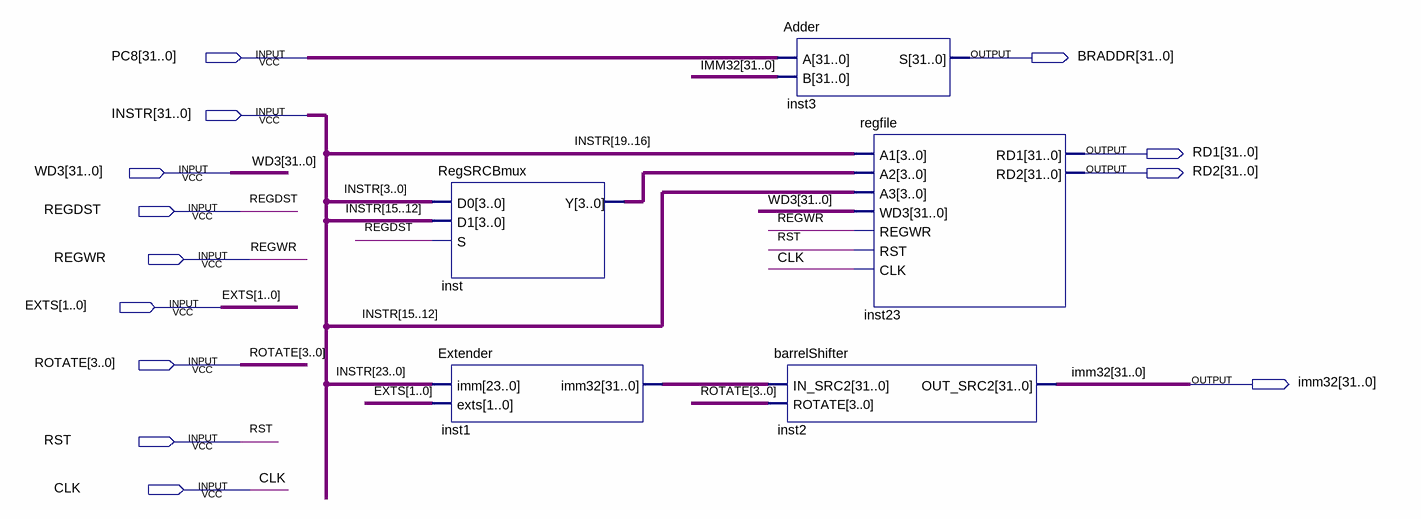
[diagram p0: schematic sheet]
// Quartus schematic Decode.bdf as structural Verilog: 5 symbols, 13 pins
module Decode (
  input  [31:0] PC8,
  input  [31:0] INSTR,
  input  [31:0] WD3,
  input  REGDST,
  input  REGWR,
  input  [1:0] EXTS,
  input  [3:0] ROTATE,
  input  RST,
  input  CLK,
  output [31:0] BRADDR,
  output [31:0] RD1,
  output [31:0] RD2,
  output [31:0] imm32
);

  wire [3:0] inst_y;
  wire [31:0] inst1_imm32;

  RegSRCBmux inst (.D0(INSTR[3:0]), .D1(INSTR[15:12]), .S(REGDST), .Y(inst_y));
  Extender inst1 (.imm(INSTR[23:0]), .exts(EXTS), .imm32(inst1_imm32));
  Adder inst3 (.A(PC8), .B(imm32), .S(BRADDR));
  barrelShifter inst2 (.IN_SRC2(inst1_imm32), .ROTATE(ROTATE), .OUT_SRC2(imm32));
  regfile inst23 (
    .A1(INSTR[19:16]), .A2(inst_y), .A3(INSTR[15:12]), .WD3(WD3), .REGWR(REGWR), .RST(RST), .CLK(CLK),
    .RD1(RD1), .RD2(RD2));
endmodule
